# Altium project MagnetorquerFinalBoard.PrjPcb
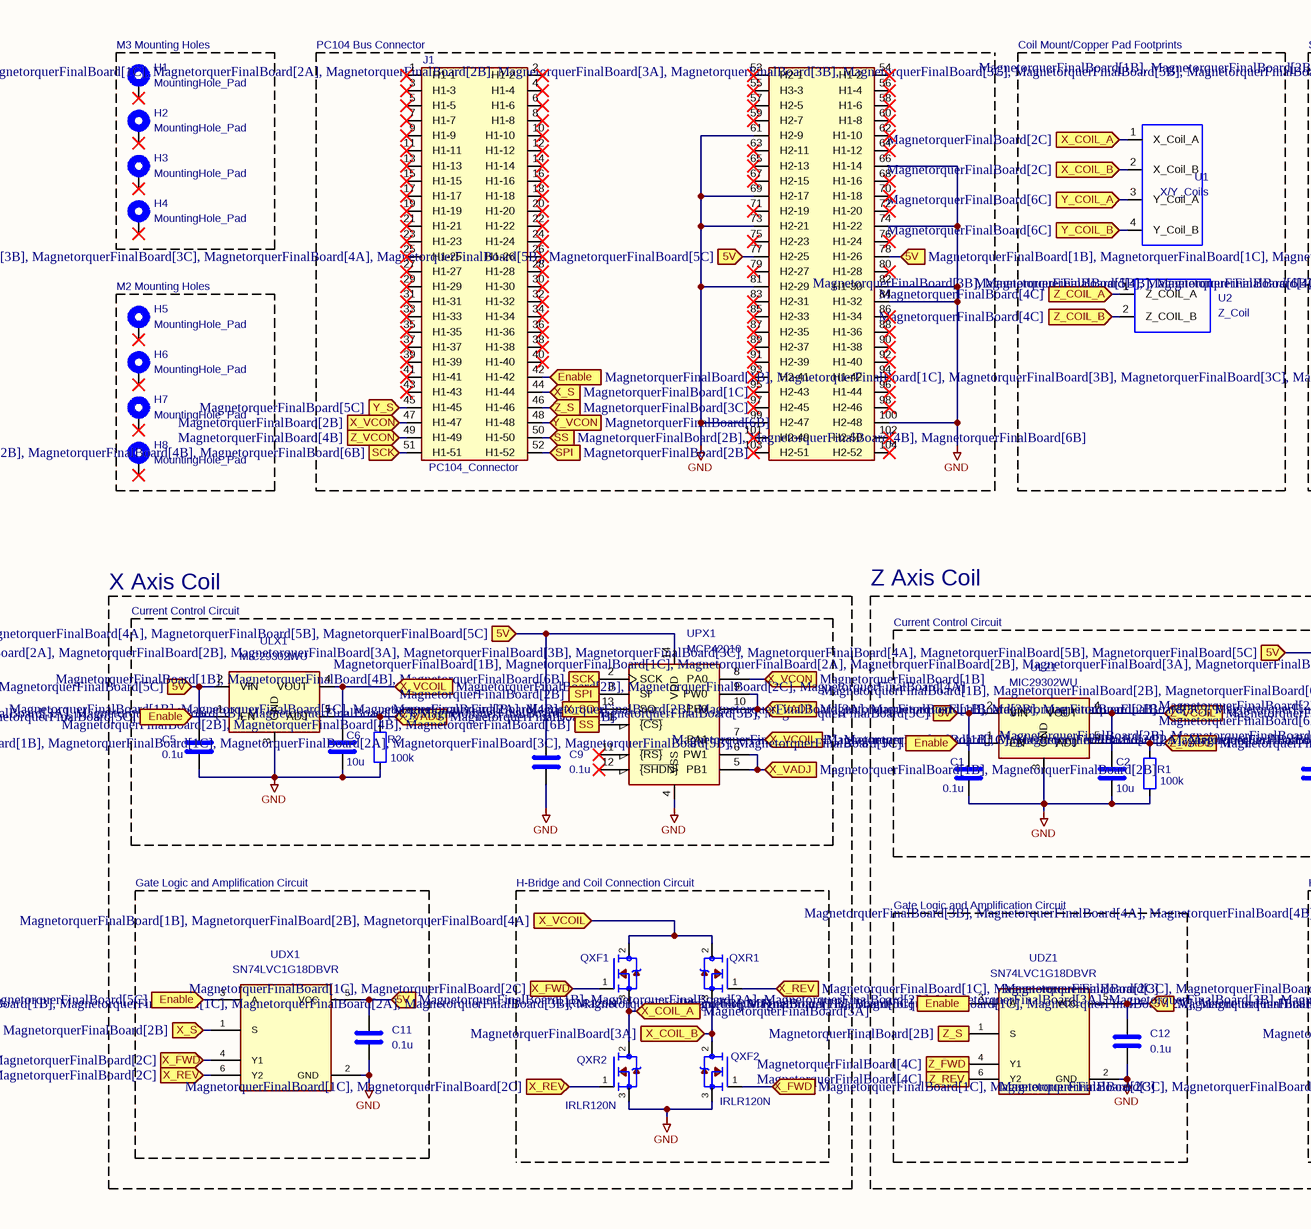
[diagram p0: MagnetorquerFinalBoard.SchDoc, left]
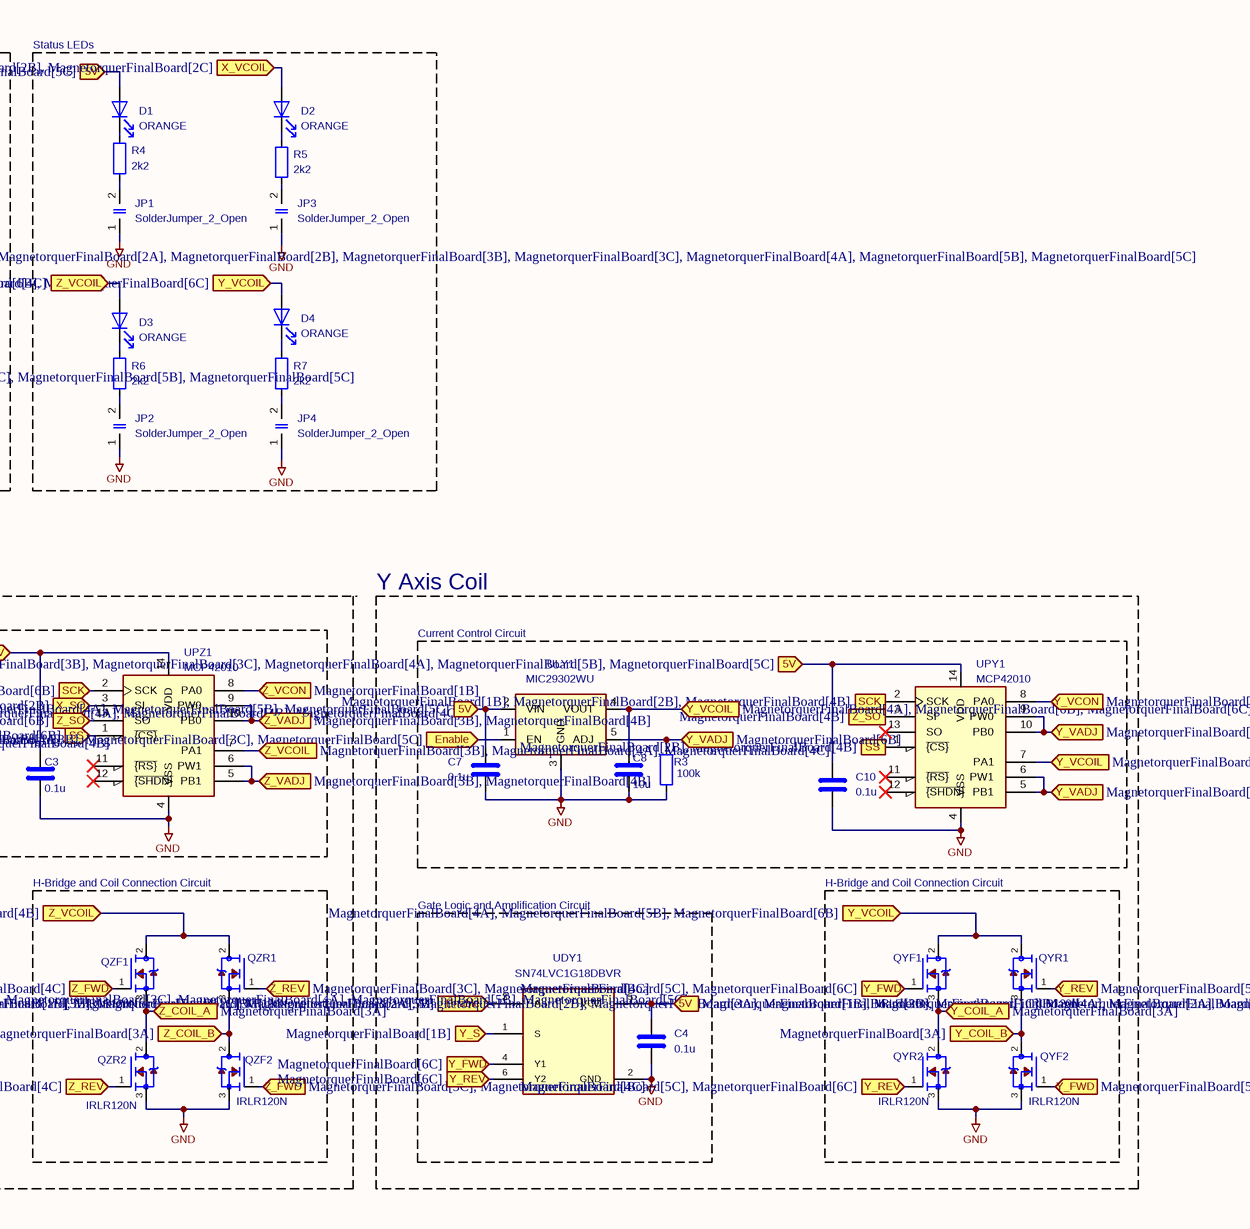
[diagram p1: MagnetorquerFinalBoard.SchDoc, right]
1 sheet, 59 parts. Net scope: flat (ports and power ports of the same name join across sheets).
Board files: MagnetorquerFinalBoard.PcbDoc, MagnetorquerFinalBoard(1).PcbDoc

## Sheet MagnetorquerFinalBoard.SchDoc
size 420 x 297 mm

### Parts
C1  0.1u  [C_0603_1608Metric]
C2  10u  [C_0603_1608Metric]
C3  0.1u  [C_0603_1608Metric]
C4  0.1u  [C_0603_1608Metric]
C5  0.1u  [C_0603_1608Metric]
C6  10u  [C_0603_1608Metric]
C7  0.1u  [C_0603_1608Metric]
C8  10u  [C_0603_1608Metric]
C9  0.1u  [C_0603_1608Metric]
C10  0.1u  [C_0603_1608Metric]
C11  0.1u  [C_0603_1608Metric]
C12  0.1u  [C_0603_1608Metric]
D1  ORANGE  [LED_0603_1608Metric]
D2  ORANGE  [LED_0603_1608Metric]
D3  ORANGE  [LED_0603_1608Metric]
D4  ORANGE  [LED_0603_1608Metric]
H1  MountingHole_Pad  [MountingHole_3.2mm_M3_Pad_TopBottom]
H2  MountingHole_Pad  [MountingHole_3.2mm_M3_Pad_TopBottom]
H3  MountingHole_Pad  [MountingHole_3.2mm_M3_Pad_TopBottom]
H4  MountingHole_Pad  [MountingHole_3.2mm_M3_Pad_TopBottom]
H5  MountingHole_Pad  [MountingHole_2.2mm_M2_Pad_TopBottom]
H6  MountingHole_Pad  [MountingHole_2.2mm_M2_Pad_TopBottom]
H7  MountingHole_Pad  [MountingHole_2.2mm_M2_Pad_TopBottom]
H8  MountingHole_Pad  [MountingHole_2.2mm_M2_Pad_TopBottom]
J1  PC104_Connector  [pc104-connector]
JP1  SolderJumper_2_Open  [SolderJumper-2_P1.3mm_Open_TrianglePad1.0x1.5mm]
JP2  SolderJumper_2_Open  [SolderJumper-2_P1.3mm_Open_TrianglePad1.0x1.5mm]
JP3  SolderJumper_2_Open  [SolderJumper-2_P1.3mm_Open_TrianglePad1.0x1.5mm]
JP4  SolderJumper_2_Open  [SolderJumper-2_P1.3mm_Open_TrianglePad1.0x1.5mm]
QXF1  IRLR120N  [TO-252-2]
QXF2  IRLR120N  [TO-252-2]
QXR1  IRLR120N  [TO-252-2]
QXR2  IRLR120N  [TO-252-2]
QYF1  IRLR120N  [TO-252-2]
QYF2  IRLR120N  [TO-252-2]
QYR1  IRLR120N  [TO-252-2]
QYR2  IRLR120N  [TO-252-2]
QZF1  IRLR120N  [TO-252-2]
QZF2  IRLR120N  [TO-252-2]
QZR1  IRLR120N  [TO-252-2]
QZR2  IRLR120N  [TO-252-2]
R1  100k  [R_0603_1608Metric]
R2  100k  [R_0603_1608Metric]
R3  100k  [R_0603_1608Metric]
R4  2k2  [R_0603_1608Metric]
R5  2k2  [R_0603_1608Metric]
R6  2k2  [R_0603_1608Metric]
R7  2k2  [R_0603_1608Metric]
U1  X/Y_Coils  [Front Coils Mount]
U2  Z_Coil  [ZCoil]
UDX1  SN74LVC1G18DBVR  [SOT95P280X145-6N]
UDY1  SN74LVC1G18DBVR  [SOT95P280X145-6N]
UDZ1  SN74LVC1G18DBVR  [SOT95P280X145-6N]
ULX1  MIC29302WU  [TO-263-5_TabPin3]
ULY1  MIC29302WU  [TO-263-5_TabPin3]
ULZ1  MIC29302WU  [TO-263-5_TabPin3]
UPX1  MCP42010  [SOIC127P600X175-14N]
UPY1  MCP42010  [SOIC127P600X175-14N]
UPZ1  MCP42010  [SOIC127P600X175-14N]

### Blocks framed on the sheet
M3 Mounting Holes: H1-H4
PC104 Bus Connector: J1
Coil Mount/Copper Pad Footprints: U1 U2
Status LEDs: D1-D4 JP1-JP4 R4-R7
M2 Mounting Holes: H5-H8
Current Control Circuit: C5 C6 C9 R2 ULX1 UPX1
Current Control Circuit: C1-C3 R1 ULZ1 UPZ1
Current Control Circuit: C7 C8 C10 R3 ULY1 UPY1
Gate Logic and Amplification Circuit: C11 UDX1
H-Bridge and Coil Connection Circuit: QXF1 QXF2 QXR1 QXR2
H-Bridge and Coil Connection Circuit: QZF1 QZF2 QZR1 QZR2
H-Bridge and Coil Connection Circuit: QYF1 QYF2 QYR1 QYR2
Gate Logic and Amplification Circuit: C12 UDZ1
Gate Logic and Amplification Circuit: C4 UDY1

### Ports
5V (in, see MagnetorquerFinalBoard[1B], MagnetorquerFinalBoard[1C], MagnetorquerFinalBoard[2A], MagnetorquerFinalBoard[2B], MagnetorquerFinalBoard[3A], MagnetorquerFinalBoard[3B], MagnetorquerFinalBoard[3C], MagnetorquerFinalBoard[4A], MagnetorquerFinalBoard[5B]), 5V (in, see MagnetorquerFinalBoard[1B], MagnetorquerFinalBoard[1C], MagnetorquerFinalBoard[2A], MagnetorquerFinalBoard[2B], MagnetorquerFinalBoard[3A], MagnetorquerFinalBoard[3B], MagnetorquerFinalBoard[3C], MagnetorquerFinalBoard[4A], MagnetorquerFinalBoard[5B], MagnetorquerFinalBoard[5C]), 5V (in, see MagnetorquerFinalBoard[1B], MagnetorquerFinalBoard[1C], MagnetorquerFinalBoard[2A], MagnetorquerFinalBoard[2B], MagnetorquerFinalBoard[3A], MagnetorquerFinalBoard[3B], MagnetorquerFinalBoard[3C], MagnetorquerFinalBoard[5B], MagnetorquerFinalBoard[5C]), 5V (in, see MagnetorquerFinalBoard[1B], MagnetorquerFinalBoard[1C], MagnetorquerFinalBoard[2A], MagnetorquerFinalBoard[2B], MagnetorquerFinalBoard[3A], MagnetorquerFinalBoard[3B], MagnetorquerFinalBoard[4A], MagnetorquerFinalBoard[5B], MagnetorquerFinalBoard[5C]), 5V (in, see MagnetorquerFinalBoard[1B], MagnetorquerFinalBoard[1C], MagnetorquerFinalBoard[2A], MagnetorquerFinalBoard[2B], MagnetorquerFinalBoard[3B], MagnetorquerFinalBoard[3C], MagnetorquerFinalBoard[4A], MagnetorquerFinalBoard[5B], MagnetorquerFinalBoard[5C]), 5V (in, see MagnetorquerFinalBoard[1B], MagnetorquerFinalBoard[1C], MagnetorquerFinalBoard[2A], MagnetorquerFinalBoard[3A], MagnetorquerFinalBoard[3B], MagnetorquerFinalBoard[3C], MagnetorquerFinalBoard[4A], MagnetorquerFinalBoard[5B], MagnetorquerFinalBoard[5C]), 5V (in, see MagnetorquerFinalBoard[1B], MagnetorquerFinalBoard[1C], MagnetorquerFinalBoard[2B], MagnetorquerFinalBoard[3A], MagnetorquerFinalBoard[3B], MagnetorquerFinalBoard[3C], MagnetorquerFinalBoard[4A], MagnetorquerFinalBoard[5B], MagnetorquerFinalBoard[5C]), 5V (in, see MagnetorquerFinalBoard[1B], MagnetorquerFinalBoard[2A], MagnetorquerFinalBoard[2B], MagnetorquerFinalBoard[3A], MagnetorquerFinalBoard[3B], MagnetorquerFinalBoard[3C], MagnetorquerFinalBoard[4A], MagnetorquerFinalBoard[5B], MagnetorquerFinalBoard[5C]), 5V (in, see MagnetorquerFinalBoard[1C], MagnetorquerFinalBoard[2A], MagnetorquerFinalBoard[2B], MagnetorquerFinalBoard[3A], MagnetorquerFinalBoard[3B], MagnetorquerFinalBoard[3C], MagnetorquerFinalBoard[4A], MagnetorquerFinalBoard[5B], MagnetorquerFinalBoard[5C]), Enable (in, see MagnetorquerFinalBoard[1B], MagnetorquerFinalBoard[1C], MagnetorquerFinalBoard[2A], MagnetorquerFinalBoard[3B], MagnetorquerFinalBoard[3C], MagnetorquerFinalBoard[5B]), Enable (in, see MagnetorquerFinalBoard[1B], MagnetorquerFinalBoard[1C], MagnetorquerFinalBoard[2A], MagnetorquerFinalBoard[3B], MagnetorquerFinalBoard[3C], MagnetorquerFinalBoard[5C]), Enable (in, see MagnetorquerFinalBoard[1B], MagnetorquerFinalBoard[1C], MagnetorquerFinalBoard[2A], MagnetorquerFinalBoard[3B], MagnetorquerFinalBoard[5B], MagnetorquerFinalBoard[5C]), Enable (in, see MagnetorquerFinalBoard[1B], MagnetorquerFinalBoard[1C], MagnetorquerFinalBoard[2A], MagnetorquerFinalBoard[3C], MagnetorquerFinalBoard[5B], MagnetorquerFinalBoard[5C]), Enable (in, see MagnetorquerFinalBoard[1B], MagnetorquerFinalBoard[1C], MagnetorquerFinalBoard[3B], MagnetorquerFinalBoard[3C], MagnetorquerFinalBoard[5B], MagnetorquerFinalBoard[5C]), Enable (in, see MagnetorquerFinalBoard[1B], MagnetorquerFinalBoard[2A], MagnetorquerFinalBoard[3B], MagnetorquerFinalBoard[3C], MagnetorquerFinalBoard[5B], MagnetorquerFinalBoard[5C]), Enable (in, see MagnetorquerFinalBoard[1C], MagnetorquerFinalBoard[2A], MagnetorquerFinalBoard[3B], MagnetorquerFinalBoard[3C], MagnetorquerFinalBoard[5B], MagnetorquerFinalBoard[5C]), SCK (in, see MagnetorquerFinalBoard[1B], MagnetorquerFinalBoard[2B], MagnetorquerFinalBoard[4B]), SCK (in, see MagnetorquerFinalBoard[1B], MagnetorquerFinalBoard[2B], MagnetorquerFinalBoard[6B]), SCK (in, see MagnetorquerFinalBoard[1B], MagnetorquerFinalBoard[4B], MagnetorquerFinalBoard[6B]), SCK (in, see MagnetorquerFinalBoard[2B], MagnetorquerFinalBoard[4B], MagnetorquerFinalBoard[6B]), SPI (in, see MagnetorquerFinalBoard[2B]), SS (in, see MagnetorquerFinalBoard[2B], MagnetorquerFinalBoard[4B]), SS (in, see MagnetorquerFinalBoard[2B], MagnetorquerFinalBoard[4B], MagnetorquerFinalBoard[6B]), SS (in, see MagnetorquerFinalBoard[2B], MagnetorquerFinalBoard[6B]), X_COIL_A (in, see MagnetorquerFinalBoard[2C]), X_COIL_A (in, see MagnetorquerFinalBoard[3A]), X_COIL_B (in, see MagnetorquerFinalBoard[2C]), X_COIL_B (in, see MagnetorquerFinalBoard[3A]), X_FWD (in, see MagnetorquerFinalBoard[1C], MagnetorquerFinalBoard[2C]), X_FWD (in, see MagnetorquerFinalBoard[2C]), X_REV (in, see MagnetorquerFinalBoard[1C], MagnetorquerFinalBoard[2C]), X_REV (in, see MagnetorquerFinalBoard[2C]), X_S (in, see MagnetorquerFinalBoard[1C]), X_S (in, see MagnetorquerFinalBoard[2B]), X_SO (in, see MagnetorquerFinalBoard[2B]), X_SO (in, see MagnetorquerFinalBoard[4B]), X_VADJ (in, see MagnetorquerFinalBoard[1B], MagnetorquerFinalBoard[2B]), X_VADJ (in, see MagnetorquerFinalBoard[2B]), X_VCOIL (in, see MagnetorquerFinalBoard[1B], MagnetorquerFinalBoard[2B], MagnetorquerFinalBoard[2C]), X_VCOIL (in, see MagnetorquerFinalBoard[1B], MagnetorquerFinalBoard[2B], MagnetorquerFinalBoard[4A]), X_VCOIL (in, see MagnetorquerFinalBoard[1B], MagnetorquerFinalBoard[2C], MagnetorquerFinalBoard[4A]), X_VCOIL (in, see MagnetorquerFinalBoard[2B], MagnetorquerFinalBoard[2C], MagnetorquerFinalBoard[4A]), X_VCON (in, see MagnetorquerFinalBoard[1B]), X_VCON (in, see MagnetorquerFinalBoard[2B]), Y_COIL_A (in, see MagnetorquerFinalBoard[3A]), Y_COIL_A (in, see MagnetorquerFinalBoard[6C]), Y_COIL_B (in, see MagnetorquerFinalBoard[3A]), Y_COIL_B (in, see MagnetorquerFinalBoard[6C]), Y_FWD (in, see MagnetorquerFinalBoard[5C], MagnetorquerFinalBoard[6C]), Y_FWD (in, see MagnetorquerFinalBoard[6C]), Y_REV (in, see MagnetorquerFinalBoard[5C], MagnetorquerFinalBoard[6C]), Y_REV (in, see MagnetorquerFinalBoard[6C]), Y_S (in, see MagnetorquerFinalBoard[1B]), Y_S (in, see MagnetorquerFinalBoard[5C]), Y_VADJ (in, see MagnetorquerFinalBoard[5B], MagnetorquerFinalBoard[6B]), Y_VADJ (in, see MagnetorquerFinalBoard[6B]), Y_VCOIL (in, see MagnetorquerFinalBoard[4A], MagnetorquerFinalBoard[5B], MagnetorquerFinalBoard[6B]), Y_VCOIL (in, see MagnetorquerFinalBoard[4A], MagnetorquerFinalBoard[5B], MagnetorquerFinalBoard[6C]), Y_VCOIL (in, see MagnetorquerFinalBoard[4A], MagnetorquerFinalBoard[6B], MagnetorquerFinalBoard[6C]), Y_VCOIL (in, see MagnetorquerFinalBoard[5B], MagnetorquerFinalBoard[6B], MagnetorquerFinalBoard[6C]), Y_VCON (in, see MagnetorquerFinalBoard[2B]), Y_VCON (in, see MagnetorquerFinalBoard[6B]), Z_COIL_A (in, see MagnetorquerFinalBoard[3A]), Z_COIL_A (in, see MagnetorquerFinalBoard[4C]), Z_COIL_B (in, see MagnetorquerFinalBoard[3A]), Z_COIL_B (in, see MagnetorquerFinalBoard[4C]), Z_FWD (in, see MagnetorquerFinalBoard[3C], MagnetorquerFinalBoard[4C]), Z_FWD (in, see MagnetorquerFinalBoard[4C]), Z_REV (in, see MagnetorquerFinalBoard[3C], MagnetorquerFinalBoard[4C]), Z_REV (in, see MagnetorquerFinalBoard[4C]), Z_S (in, see MagnetorquerFinalBoard[2B]), Z_S (in, see MagnetorquerFinalBoard[3C]), Z_SO (in, see MagnetorquerFinalBoard[4B]), Z_SO (in, see MagnetorquerFinalBoard[6B]), Z_VADJ (in, see MagnetorquerFinalBoard[3B], MagnetorquerFinalBoard[4B]), Z_VADJ (in, see MagnetorquerFinalBoard[4B]), Z_VCOIL (in, see MagnetorquerFinalBoard[3B], MagnetorquerFinalBoard[4A], MagnetorquerFinalBoard[4B]), Z_VCOIL (in, see MagnetorquerFinalBoard[3B], MagnetorquerFinalBoard[4A], MagnetorquerFinalBoard[4C]), Z_VCOIL (in, see MagnetorquerFinalBoard[3B], MagnetorquerFinalBoard[4B], MagnetorquerFinalBoard[4C]), Z_VCOIL (in, see MagnetorquerFinalBoard[4A], MagnetorquerFinalBoard[4B], MagnetorquerFinalBoard[4C]), Z_VCON (in, see MagnetorquerFinalBoard[1B]), Z_VCON (in, see MagnetorquerFinalBoard[4B])

### Nets
GND: C1.2 C2.2 C3.2 C4.2 C5.2 C6.2 C7.2 C8.2 C9.2 C10.2 C11.2 C12.2 J1.61(H2-9) J1.66(H1-14) J1.69(H2-17) J1.73(H2-21) J1.74(H1-22) J1.81(H2-29) J1.82(H1-30) J1.84(H1-32) J1.99(H2-47) J1.100(H2-48) JP1.1(A) JP2.1(A) JP3.1(A) JP4.1(A) QXF2.3 QXR2.3 QYF2.3 QYR2.3 QZF2.3 QZR2.3 R1.1 R2.1 R3.1 UDX1.2(GND) UDY1.2(GND) UDZ1.2(GND) ULX1.3(GND) ULY1.3(GND) ULZ1.3(GND) UPX1.4(VSS) UPY1.4(VSS) UPZ1.4(VSS)
5V: C1.1 C3.1 C4.1 C5.1 C7.1 C9.1 C10.1 C11.1 C12.1 D1.2(A) J1.77(H2-25) J1.78(H1-26) UDX1.5(VCC) UDY1.5(VCC) UDZ1.5(VCC) ULX1.2(VIN) ULY1.2(VIN) ULZ1.2(VIN) UPX1.14(VDD) UPY1.14(VDD) UPZ1.14(VDD) ; port 5V
Enable: J1.42(H1-42) UDX1.3(A) UDY1.3(A) UDZ1.3(A) ULX1.1(EN) ULY1.1(EN) ULZ1.1(EN) ; port Enable
SCK: J1.51(H1-51) UPX1.2(SCK) UPY1.2(SCK) UPZ1.2(SCK) ; port SCK
SPI: J1.52(H1-52) UPX1.3(SI) ; port SPI
SS: J1.50(H1-50) UPX1.1(~{{CS}}) UPY1.1(~{{CS}}) UPZ1.1(~{{CS}}) ; port SS
X_COIL_A: QXF1.3 QXR2.2 U1.1(X_Coil_A) ; port X_COIL_A
X_COIL_B: QXF2.2 QXR1.3 U1.2(X_Coil_B) ; port X_COIL_B
X_FWD: QXF1.1 QXF2.1 UDX1.4(Y1) ; port X_FWD
X_REV: QXR1.1 QXR2.1 UDX1.6(Y2) ; port X_REV
X_S: J1.44(H1-44) UDX1.1(S) ; port X_S
X_SO: UPX1.13(SO) UPZ1.3(SI) ; port X_SO
X_VADJ: R2.2 ULX1.5(ADJ) UPX1.5(PB1) UPX1.6(PW1) UPX1.9(PW0) UPX1.10(PB0) ; port X_VADJ
X_VCOIL: C6.1 D2.2(A) QXF1.2 QXR1.2 ULX1.4(VOUT) UPX1.7(PA1) ; port X_VCOIL
X_VCON: J1.47(H1-47) UPX1.8(PA0) ; port X_VCON
Y_COIL_A: QYF1.3 QYR2.2 U1.3(Y_Coil_A) ; port Y_COIL_A
Y_COIL_B: QYF2.2 QYR1.3 U1.4(Y_Coil_B) ; port Y_COIL_B
Y_FWD: QYF1.1 QYF2.1 UDY1.4(Y1) ; port Y_FWD
Y_REV: QYR1.1 QYR2.1 UDY1.6(Y2) ; port Y_REV
Y_S: J1.45(H1-45) UDY1.1(S) ; port Y_S
Y_VADJ: R3.2 ULY1.5(ADJ) UPY1.5(PB1) UPY1.6(PW1) UPY1.9(PW0) UPY1.10(PB0) ; port Y_VADJ
Y_VCOIL: C8.1 D4.2(A) QYF1.2 QYR1.2 ULY1.4(VOUT) UPY1.7(PA1) ; port Y_VCOIL
Y_VCON: J1.48(H1-48) UPY1.8(PA0) ; port Y_VCON
Z_COIL_A: QZF1.3 QZR2.2 U2.1(Z_COIL_A) ; port Z_COIL_A
Z_COIL_B: QZF2.2 QZR1.3 U2.2(Z_COIL_B) ; port Z_COIL_B
Z_FWD: QZF1.1 QZF2.1 UDZ1.4(Y1) ; port Z_FWD
Z_REV: QZR1.1 QZR2.1 UDZ1.6(Y2) ; port Z_REV
Z_S: J1.46(H1-46) UDZ1.1(S) ; port Z_S
Z_SO: UPY1.3(SI) UPZ1.13(SO) ; port Z_SO
Z_VADJ: R1.2 ULZ1.5(ADJ) UPZ1.5(PB1) UPZ1.6(PW1) UPZ1.9(PW0) UPZ1.10(PB0) ; port Z_VADJ
Z_VCOIL: C2.1 D3.2(A) QZF1.2 QZR1.2 ULZ1.4(VOUT) UPZ1.7(PA1) ; port Z_VCOIL
Z_VCON: J1.49(H1-49) UPZ1.8(PA0) ; port Z_VCON
NetD1_1: D1.1(K) R4.1
NetD2_1: D2.1(K) R5.1
NetD3_1: D3.1(K) R6.1
NetD4_1: D4.1(K) R7.1
NetJP1_2: JP1.2(B) R4.2
NetJP2_2: JP2.2(B) R6.2
NetJP3_2: JP3.2(B) R5.2
NetJP4_2: JP4.2(B) R7.2

Not connected (* = marked no-connect by the designer): H1 1*; H2 1*; H3 1*; H4 1*; H5 1*; H6 1*; H7 1*; H8 1*; J1 1(H1-1)* 2(H1-2)* 3(H1-3)* 4(H1-4)* 5(H1-5)* 6(H1-6)* 7(H1-7)* 8(H1-8)* 9(H1-9)* 10(H1-10)* 11(H1-11)* 12(H1-12)* 13(H1-13)* 14(H1-14)* 15(H1-15)* 16(H1-16)* 17(H1-17)* 18(H1-18)* 19(H1-19)* 20(H1-20)* 21(H1-21)* 22(H1-22)* 23(H1-23)* 24(H1-24)* 25(H1-25)* 26(H1-26)* 27(H1-27)* 28(H1-28)* 29(H1-29)* 30(H1-30)* 31(H1-31)* 32(H1-32)* 33(H1-33)* 34(H1-34)* 35(H1-35)* 36(H1-36)* 37(H1-37)* 38(H1-38)* 39(H1-39)* 40(H1-40)* 41(H1-41)* 43(H1-43)* 53(H2-1)* 54(H1-2)* 55(H3-3)* 56(H1-4)* 57(H2-5)* 58(H1-6)* 59(H2-7)* 60(H1-8)* 62(H1-10)* 63(H2-11)* 64(H1-12)* 65(H2-13)* 67(H2-15)* 68(H1-16)* 70(H1-18)* 71(H2-19)* 72(H1-20)* 75(H2-23)* 76(H1-24)* 79(H2-27)* 80(H1-28)* 83(H2-31)* 85(H2-33)* 86(H1-34)* 87(H2-35)* 88(H1-36)* 89(H2-37)* 90(H1-38)* 91(H2-39)* 92(H1-40)* 93(H2-41)* 94(H1-42)* 95(H2-43)* 96(H1-44)* 97(H2-45)* 98(H2-46)* 101(H2-49)* 102(H2-50)* 103(H2-51)* 104(H2-52)*; UPX1 11(~{{RS}})* 12(~{{SHDN}})*; UPY1 11(~{{RS}})* 12(~{{SHDN}})* 13(SO)*; UPZ1 11(~{{RS}})* 12(~{{SHDN}})*

### Notes on the sheet
- X Axis Coil
- Z Axis Coil
- Y Axis Coil
- 1
- 2
- 3
- 4
- 5
- 6
- 7
- 8
- A
- B
- C
- D
- E
- Title:
- File: MagnetorquerFinalBoard.kicad_sch
- Sheet: /
- F
- KiCad E.D.A.  kicad (5.1.4)-1
- Size: A3
- Date:
- Rev:
- Id: 1/1

### Library data of the parts
C1-C12 = C: Footprint: Capacitor_SMD:C_0603_1608Metric
  C1 C3-C5 C7 C9-C12: Value: 0.1u
  C2 C6 C8: Value: 10u
D1-D4 = LED: Value: ORANGE; Footprint: LED_SMD:LED_0603_1608Metric
QXF1 QXF2 QXR1 QXR2 QYF1 QYF2 QYR1 QYR2 QZF1 QZF2 QZR1 QZR2 = IRLR120N: MANUFACTURER: Infineon Technologies; MAXIMUM_PACKAGE_HIEGHT: 2.39mm; PARTREV: july 2014; STANDARD: IPC7351B; Value: IRLR120N; Footprint: Package_TO_SOT_SMD:TO-252-2
R1-R7 = R: Footprint: Resistor_SMD:R_0603_1608Metric
  R1-R3: Value: 100k
  R4-R7: Value: 2k2
U1 = X{slash}Y_Coils: Value: X/Y_Coils; Footprint: CoilFootprints:Front Coils Mount
H1-H8 = MountingHole_Pad: Value: MountingHole_Pad
  H1-H4: Footprint: MountingHole:MountingHole_3.2mm_M3_Pad_TopBottom
  H5-H8: Footprint: MountingHole:MountingHole_2.2mm_M2_Pad_TopBottom
J1 = PC104_Connector: Value: PC104_Connector; Footprint: pc104-connector:pc104-connector
JP1-JP4 = SolderJumper_2_Open: Value: SolderJumper_2_Open; Footprint: Jumper:SolderJumper-2_P1.3mm_Open_TrianglePad1.0x1.5mm
U2 = Z_Coil: Value: Z_Coil; Footprint: MCP42010-E_SL:ZCoil
UDX1 UDY1 UDZ1 = SN74LVC1G18DBVR: Value: SN74LVC1G18DBVR; Footprint: SN74LVC1G18DBVR:SOT95P280X145-6N
ULX1 ULY1 ULZ1 = MIC29302WU: Value: MIC29302WU; Footprint: Package_TO_SOT_SMD:TO-263-5_TabPin3
UPX1 UPY1 UPZ1 = MCP42010: Value: MCP42010; Footprint: MCP42010-E_SL:SOIC127P600X175-14N